# Altium schematic sheet Power and MCU.SchDoc
size A4
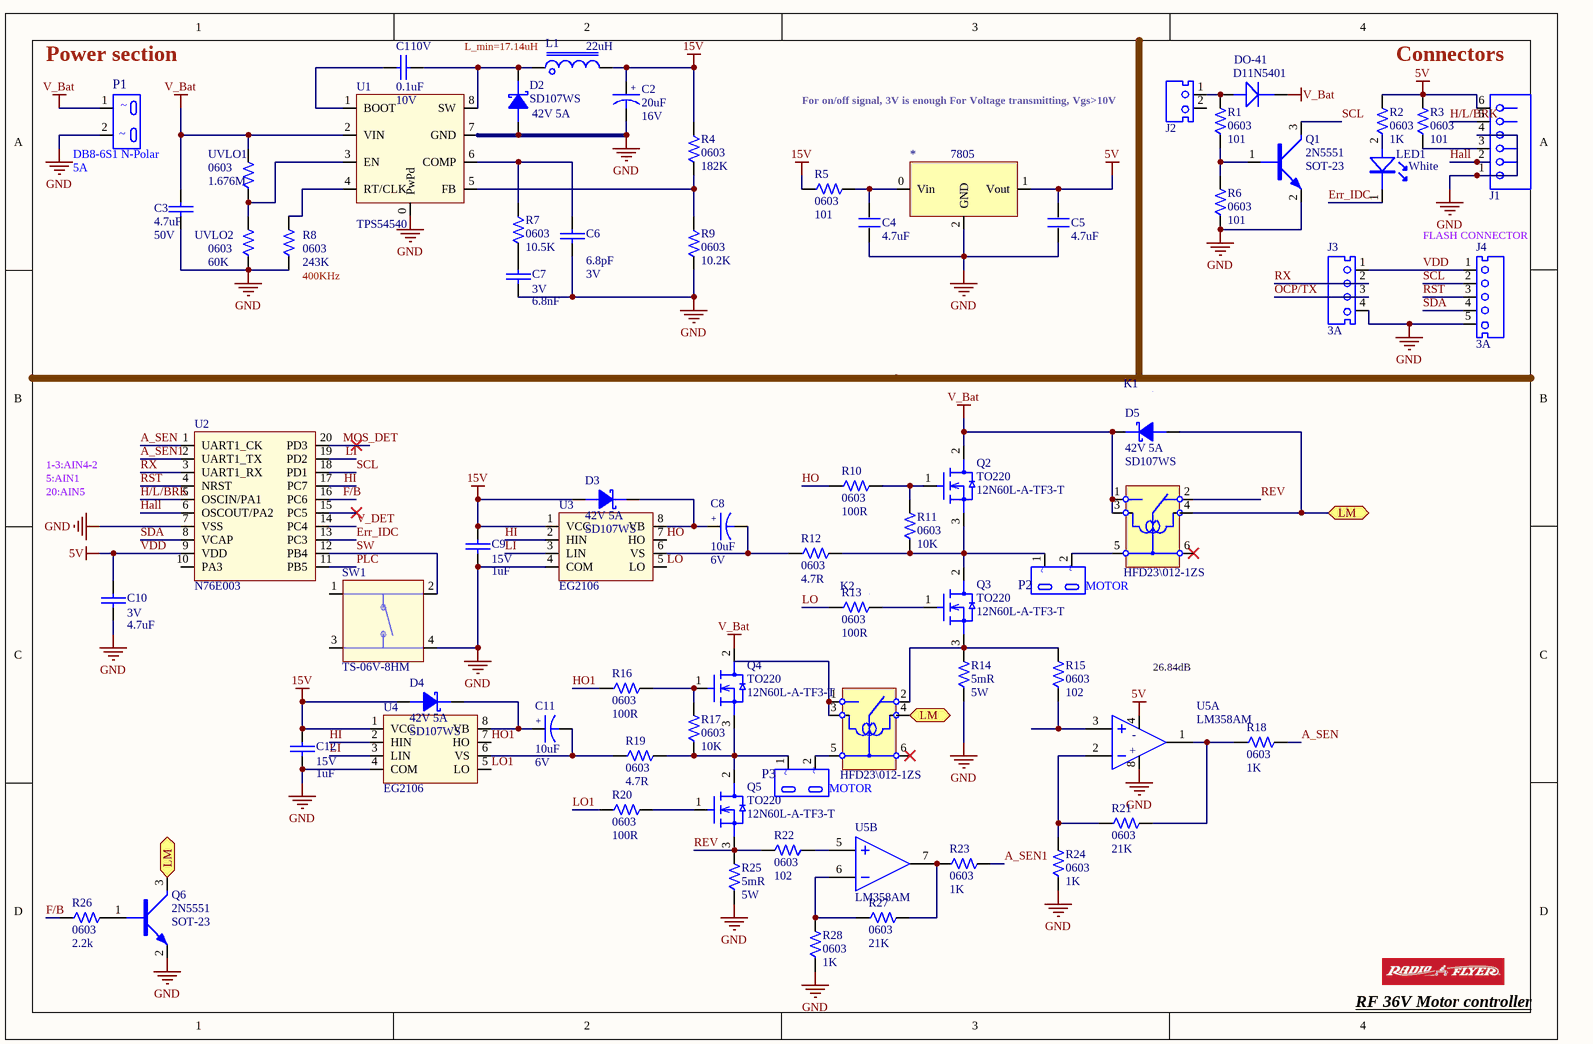
[diagram p0: Power and MCU.SchDoc]

## Parts
*  7805  [2SC2712GR]
C1  10V  value 0.1uF  [CAPC0201]
C2  value 20uF  Voltage: 16V  [CASE - D]  (hidden comment: PBE099540-1010)
C3  value 4.7uF  Voltage: 50V  [CAPC0201]  (hidden comment: 10V)
C4  4.7uF  [0603P]
C5  4.7uF  [0603P]
C6  value 6.8pF  Voltage: 3V  [CAPC0201]  (hidden comment: 10V)
C7  value 6.8nF  [CAPC0201]  (hidden comment: 3V)
C8  value 10uF  Voltage: 6V  [CASE - D]  (hidden comment: PBE099540-1010)
C9  value 1uF  Voltage: 15V  [CAPC0201]  (hidden comment: 3V)
C10  value 4.7uF  [CAPC0201]  (hidden comment: 3V)
C11  value 10uF  Voltage: 6V  [CASE - D]  (hidden comment: PBE099540-1010)
C12  value 1uF  Voltage: 15V  [CAPC0201]  (hidden comment: 3V)
D1  MFG Part: 1N5401  Package: DO-41  [DO-41-V-P5.08]  (hidden comment: RAD114004-0010)
D2  42V 5A  [SOD-323]
D3  42V 5A  [SOD-323]
D4  42V 5A  [SOD-323]
D5  42V 5A  [SOD-323]
J1  T690300121600  [CONN 6P PH=2.5mm RA XHB-6AW-KL]  (value not drawn)
J2  T690300125300  [CONN 2P PH=2.5mm HAA250A-2 WHITE]  (value not drawn)
J3  Current: 3A  [CONN 4P PH=2.5mm B4B-XH-A]  (hidden comment: CCN250000-0104)
J4  Current: 3A  [CONN 5P PH=2.5mm B5B-XH-A]  (hidden comment: CCN250000-0105)
K1  MFG Part: HFD23\012-1ZS  [RELAY HFD23/012-1ZS]  (hidden comment: RELAY HFD23/012-1ZS)
K2  MFG Part: HFD23\012-1ZS  [RELAY HFD23/012-1ZS]  (hidden comment: RELAY HFD23/012-1ZS)
L1  value 22uH  [IND CSAB0740]  (hidden comment: T621000090500)
LED1  Color: White  [LED 0603 JH-CW52E12SMP001]  (hidden comment: T575013160258)
P1  MFG Part: DB8-6S1 N-Polar  Current: 5A  [AC INLET 2P DB8-6S1]  (hidden comment: CJP012009-0050)
P2  MFG Part: MOTOR  [AC INLET 2P ST-A03-002MS]  (hidden comment: CJPA12002-0010)
P3  MFG Part: MOTOR  [AC INLET 2P ST-A03-002MS]  (hidden comment: CJPA12002-0010)
Q1  MFG Part: 2N5551  Package: SOT-23  [SOT23-132-RW]  (hidden comment: RCN000846-0001)
Q2  Package: TO220  [TO220-F]  (hidden comment: RHM120060-1001)
Q3  Package: TO220  [TO220-F]  (hidden comment: RHM120060-1001)
Q4  Package: TO220  [TO220-F]  (hidden comment: RHM120060-1001)
Q5  Package: TO220  [TO220-F]  (hidden comment: RHM120060-1001)
Q6  MFG Part: 2N5551  Package: SOT-23  [SOT23-132-RW]  (hidden comment: RCN000846-0001)
R1  value 101  Package: 0603  [0603-RW]  (hidden comment: T501348102129)
R2  value 1K  Package: 0603  [0603-RW]  (hidden comment: T501348102129)
R3  value 101  Package: 0603  [0603-RW]  (hidden comment: T501348102129)
R4  value 182K  Package: 0603  [0603-RW]  (hidden comment: T501348102129)
R5  value 101  Package: 0603  [0603-RW]  (hidden comment: T501348102129)
R6  value 101  Package: 0603  [0603-RW]  (hidden comment: T501348102129)
R7  value 10.5K  Package: 0603  [0603-RW]  (hidden comment: T501348102129)
R8  value 243K  Package: 0603  [0603-RW]  (hidden comment: T501348102129)
R9  value 10.2K  Package: 0603  [0603-RW]  (hidden comment: T501348102129)
R10  value 100R  Package: 0603  [0603-RW]  (hidden comment: T501348102129)
R11  value 10K  Package: 0603  [0603-RW]  (hidden comment: T501348102129)
R12  value 4.7R  Package: 0603  [0603-RW]  (hidden comment: T501348102129)
R13  value 100R  Package: 0603  [0603-RW]  (hidden comment: T501348102129)
R14  value 5mR  Power: 5W  [5W-22X10-H]  (hidden comment: QHE505000-5190)
R15  value 102  Package: 0603  [0603-RW]  (hidden comment: T501348102129)
R16  value 100R  Package: 0603  [0603-RW]  (hidden comment: T501348102129)
R17  value 10K  Package: 0603  [0603-RW]  (hidden comment: T501348102129)
R18  value 1K  Package: 0603  [0603-RW]  (hidden comment: T501348102129)
R19  value 4.7R  Package: 0603  [0603-RW]  (hidden comment: T501348102129)
R20  value 100R  Package: 0603  [0603-RW]  (hidden comment: T501348102129)
R21  value 21K  Package: 0603  [0603-RW]  (hidden comment: T501348102129)
R22  value 102  Package: 0603  [0603-RW]  (hidden comment: T501348102129)
R23  value 1K  Package: 0603  [0603-RW]  (hidden comment: T501348102129)
R24  value 1K  Package: 0603  [0603-RW]  (hidden comment: T501348102129)
R25  value 5mR  Power: 5W  [5W-22X10-H]  (hidden comment: QHE505000-5190)
R26  value 2.2k  Package: 0603  [0603-RW]  (hidden comment: T501348102129)
R27  value 21K  Package: 0603  [0603-RW]  (hidden comment: T501348102129)
R28  value 1K  Package: 0603  [0603-RW]  (hidden comment: T501348102129)
SW1  MFG Part: TS-06V-8HM  [TS_6X6X8_DIP]  (hidden comment: MSWA06012-0010)
U1  TPS54540  [SO8-EP]
U2  RCI800336-0001  [N76E003]  (value not drawn)
U3  MFG Part: EG2106  [SO8]  (hidden comment: T610900027257)
U4  MFG Part: EG2106  [SO8]  (hidden comment: T610900027257)
U5  RCI000358-0001  [SO8]  (value not drawn)  (parts A,B of 2)
UVLO1  value 1.676M  Package: 0603  [0603-RW]  (hidden comment: T501348102129)
UVLO2  value 60K  Package: 0603  [0603-RW]  (hidden comment: T501348102129)

## Ports
LM (bidir)

## Nets
15V: C2.1 C9.2 C12.2 D3.1(A) D4.1(A) L1.2 R4.1 R5.1 U3.1(VCC) U4.1(VCC)
GND: *.2(GND) C2.2 C3.1 C4.1 C5.1 C6.1 C7.1 C9.1 C10.1 C12.1 D2.1(A) J1.1 J1.4 J3.4 J4.5 P1.2 Q1.2(E) Q6.2(E) R6.1 R8.1 R9.2 R14.1 R24.1 R25.1 R28.1 SW1.4 U1.0(PwPd) U1.7(GND) U2.7(VSS) U3.4(COM) U4.4(COM) U5.8 UVLO2.1
V_Bat: C3.2 D1.2(K) D5.2(K) K1.1 K1.3 P1.1 Q2.2(D) Q4.2(D) U1.2(VIN) UVLO1.2
VDD: *.1(Vout) C5.2 C10.2 J1.6 J3.1 J4.1 R2.2 R3.2 U2.9(VDD) U5.4  [also labelled 5V]
A_SEN: R18.2 U2.1(UART1_CK)
A_SEN1: R23.2 U2.2(UART1_TX)
Err_IDC: LED1.1(K) U2.13(PC3)
F/B: R26.1 U2.16(PC6)
H/L/BRK: J1.5 U2.5(OSCIN/PA1)
Hall: J1.2 U2.6(OSCOUT/PA2)
HI: U2.17(PC7) U3.2(HIN) U4.2(HIN)
HO: R10.1 U3.7(HO)
HO1: R16.1 U4.7(HO)
LI: U2.19(PD2) U3.3(LIN) U4.3(LIN)
LM: D5.1(A) K1.4 K2.4 Q6.3(C) ; port LM
LO: R13.1 U3.5(LO)
LO1: R20.1 U4.5(LO)
MOS_DET: U2.20(PD3)
OCP/TX: J3.3
PLC: U2.11(PB5)
REV: K1.2 Q5.3(S) R22.2 R25.2
RST: J4.3 U2.4(NRST)
RX: J3.2 U2.3(UART1_RX)
SCL: J4.2 Q1.3(C) U2.18(PD1)
SDA: J4.4 U2.8(VCAP)
SW: SW1.2 U2.12(PB4)
V_DET: U2.14(PC4)
Net*_0: *.0(Vin) C4.2 R5.2
NetC1_1: C1.1 U1.1(BOOT)
NetC1_2: C1.2 D2.2(K) L1.1 U1.8(SW)
NetC6_2: C6.2 R7.1 U1.6(COMP)
NetC7_2: C7.2 R7.2
NetC8_1: C8.1 D3.2(K) U3.8(VB)
NetC8_2: C8.2 R12.1 U3.6(VS)
NetC11_1: C11.1 D4.2(K) U4.8(VB)
NetC11_2: C11.2 R19.1 U4.6(VS)
NetD1_1: D1.1(A) J2.1 R1.2
NetJ1_3: J1.3 R3.1
NetK1_5: K1.5 P2.2
NetK2_1: K2.1 K2.3
NetK2_2: K2.2 Q3.3(S) R14.2 R15.2
NetK2_5: K2.5 P3.2
NetLED1_2: LED1.2(A) R2.1
NetP2_1: P2.1 Q2.3(S) Q3.2(D) R11.1 R12.2
NetP3_1: P3.1 Q4.3(S) Q5.2(D) R17.1 R19.2
NetQ1_1: Q1.1(B) R1.1 R6.2
NetQ2_1: Q2.1(G) R10.2 R11.2
NetQ3_1: Q3.1(G) R13.2
NetQ4_1: Q4.1(G) R16.2 R17.2
NetQ5_1: Q5.1(G) R20.2
NetQ6_1: Q6.1(B) R26.2
NetR4_2: R4.2 R9.1 U1.5(FB)
NetR8_2: R8.2 U1.4(RT/CLK)
NetR15_1: R15.1 U5.3(IN+)
NetR18_1: R18.1 R21.2 U5.1(OUT)
NetR21_1: R21.1 R24.2 U5.2(IN-)
NetR22_1: R22.1 U5.5(IN+)
NetR23_1: R23.1 R27.2 U5.7(OUT)
NetR27_1: R27.1 R28.2 U5.6(IN-)
NetU1_3: U1.3(EN) UVLO1.1 UVLO2.2

Not connected (* = marked no-connect by the designer): J2 2; K1 6*; K2 6*; SW1 1 3; U2 10(PA3) 15(PC5)*

## Notes on the sheet
- L_min=17.14uH
- (near P1) Power section
- (near J2) For on/off signal, 3V is enough For Voltage transmitting, Vgs>10V
- Connectors
- (near J4) FLASH CONNECTOR
- (near R8) 400KHz
- 1-3:AIN4-2
- 5:AIN1
- 20:AIN5
- 26.84dB
- RF 36V Motor controller
- (in symbol AC INLET 2P DB8-6S1 N-Polar) ~
- (in symbol AC INLET 2P ST-A03-002MS) ~
- (in symbol CAP E 100uF 16V 20% SMD) +
- (in symbol LM358AM, part A) -; +

## Library data of the parts
C1 C3 C6 C7 C9 C10 C12 = CAP0201 0.1uF 10V 10%_X5R_MURATA: CAP X5R .10UF 10V +-10% 0201 MURATA L; MFG Part: GRM033R61A104KE15D; SAP: T545091047205; Tolerance: 10%; Type: Capacitor; CREATE_NAME: Nathan; DIP&SMD: SMD; PACKAGE: CAPC0201; Vendor Code: *; Vendor Name: *; MFG: MURATA; Other: X5R; CREATE_TIME: 01-Nov-2018; Customer Specific: N/A
  C1: Voltage: 10V
  C7 C10: Voltage: 3V
C2 C8 C11 = CAP E 100uF 16V 20% SMD: CHIP ELECT 100uF 16V 20% SMD 6.3x5.4mm; SAP: T551101434030; Vendor Name: 深圳市春明电子有限公司; Vendor Code: 10020343; Type: Capacitor; PACKAGE: CASE - D; MFG: *; MFG Part: *; Other: *; Tolerance: 20%; DIP&SMD: SMD; Customer Specific: N/A
C4 C5 = C
D1 = 1N4004S: GP DIODE  1N4004 1A 280VRMS DO-41; MFG: PANJIT; SAP: T571002250423; Vendor Name: 深圳市春明电子有限公司; Vendor Code: 10020343; Voltage: 400V; DIP&SMD: DIP; Current: 1A; Type: DIODE; Customer Specific: N/A
D2-D5 = SD107WS: Schottky Diodes , SOD-323; MFG: Micro Commercial Components; Type: DIODE; DIP&SMD: SMD; CREATE_NAME: Nathan; SAP: *; Vendor Name: *; Vendor Code: *; Voltage: *; Current: *; Customer Specific: N/A; CREATE_TIME: 17-Nov-2020; Package: SOD-323; MFG Part: SD107WS
J1 = CONN PH 6P PH=2.5mm RA XHB-6AW-KL: CONNECTOR 6PIN P=2.5 WHITE 90 K; Value: 2.5mm; MFG: 金佳电子; CREATE_NAME: Nathan; DIP&SMD: DIP; SAP: T690300121600; MFG Part: XHB-6AW-KL; Vendor Name: *; Vendor Code: *; Type: Connector; Current: *; CREATE_TIME: 27-Sep-2017
J2 = CONN 2P PH=2.5mm HAA250A-2 BLACK: CONNECTOR HA2.5 2PIN BLACK K; Value: 2.5mm; MFG: 金瑞康; CREATE_NAME: Nathan; Current: 3A; DIP&SMD: DIP; SAP: T690300125300; MFG Part: HAA250A-2 BLACK; Vendor Name: *; Vendor Code: *; Type: Connector; CREATE_TIME: 24-Nov-2017
J3 = CONN 4P PH=2.5mm B4B-XH-A: GP CONNECTOR B4B-XH-A 4 PIN; Value: 2.5mm; SAP: T690300029000; Vendor Name: 亿源电子有限公司; Vendor Code: 10009989; DIP&SMD: DIP; MFG: *; MFG Part: *; Type: Connector
J4 = CONN 5P PH=2.5mm B5B-XH-A: CONNECTOR B5B-XH-A 5 PIN; Value: 2.5mm; SAP: T690300029100; Vendor Name: 深圳市利民丰电子有限公司; Vendor Code: 10020373; DIP&SMD: DIP; MFG: *; MFG Part: *; Type: Connector
K1 K2 = RELAY HFD23/012-1ZS: MFG: HF; Voltage: 12V; CREATE_NAME: Nathan; DIP&SMD: DIP; SAP: *; Vendor Code: *; Vendor Name: *; Type: RELAY; Current: *; CREATE_TIME: 22-Mar-2021
L1 = IND 22uH CSAB0740-220M: 22UH 4A 100K SMD CODACA CSAB074 K; Type: INDUCTOR; CREATE_NAME: Nathan; DCR: 125 mohm (max.); Tolerance: 20%; SAP: T621000090500; MFG: CODACA; Vendor Code: *; Vendor Name: *; CREATE_TIME: 30-Aug-2019; Current: 4A; MFG Part: CSAB0740-220M; DIP&SMD: SMD; Customer Specific: N/A
LED1 = LED 0603 JH-CW52E12SMP001: LED W WHI 0602 JH-CW52E12SM MINGSHOU L; CREATE_NAME: Tom; DIP&SMD: SMD; MFG Part: JH-CW52E12SMP001; SAP: T575013160258; Package: 0603; MFG: MINGSHOU; Type: LED
P1 = AC INLET 2P DB8-6S1 N-Polar: AC SOCKET 2P D2.36 2.5A 250V VDE BLACK; SAP: T690300011500; MFG: 金明浩; Vendor Name: 深圳市金明浩电子科技有限公司; Vendor Code: 10010007; DIP&SMD: DIP; Value: *; Type: Connector
P2 P3 = AC INLET 2P ST-A03-002MS: AC IN SOCKET ST-A03-002MS; SAP: T690300012000; MFG: 金明浩; Vendor Name: 深圳市金明浩电子科技有限公司; Vendor Code: 10010007; DIP&SMD: DIP; Value: *; Type: Connector
Q1 Q6 = LBC846BLT1G: NPN LRC BC846BLT1G SOT23; SAP: T581003640437; Vendor Code: 10009129; Vendor Name: WING HING ENTERPRISE CO; DIP&SMD: SMD; MFG: LRC; Power: *; Voltage: *; Type: NPN; Customer Specific: N/A
Q2-Q5 = 12N60L-A-TF3-T: MOSFET 3PIN 12N60L-A -TF3-T TO-220F; SAP: T586002570924; Vendor Code: 10020223; Vendor Name: 丰富利科技（深圳）有限公司; Voltage: 600V; MFG: UTC; Current: 12A; DIP&SMD: DIP; Power: *; Type: MOSFET; Customer Specific: N/A; MFG Part: 12N60L-A-TF3-T
R1-R13 R15-R24 R26-R28 UVLO1 UVLO2 = RES0603 1/16W 0.1% 3.48K OHM: CHIP 3.48K OHM 50PPM +-0.1% 0603 WALS L; MFG Part: WF06T3481BTL; TOL: 0.1%; MFG: WALSIN; Power: 1/16 W; CREATE_NAME: Tom; DIP&SMD: SMD; SAP: T501348102129; Vendor Code: *; Vendor Name: *; Type: Resistor; CREATE_TIME: 12-Apr-2016; Customer Specific: N/A
R14 R25 = RES 5W 5% 5.1 OHM W10D9.5L22H22 QHE-5190: CEMENT RESISTOR 5.1OHM 5W 5% AXIAL; SAP: T710600010200; MFG: Xingdacheng; Vendor Code: 10008495; Vendor Name: 深圳市兴达诚电子有限公司; DIP&SMD: DIP; Package: 5W; TOL: 5%; MFG Part: RES 5W 5% 5.1 OHM W10D9.5L22H22 QHE; Type: Resistor; Customer Specific: N/A
SW1 = TACT SW H8.0 DIP: TACT SWITC 4P L6*W6*H8mm; SAP: T670200001500; MFG: ShenZhen GanHad; Force: 250gf; DIP&SMD: DIP; Vendor Code: *; Vendor Name: *; Value: TACT; Voltage: *; Current: *; Type: Switch
U1 = TPS54540: 4.5-42V input 5A output
U2 = N76E003: IC MCU 20P TSSOP20; MFG: ST; SAP: T610300083725; CREATE_NAME: GordonL@Deftronics; DIP&SMD: SMD; Vendor Code: *; Vendor Name: *; Type: IC; CREATE_TIME: 23-Mar-2014; Customer Specific: N/A; MFG Part: N76E003
U3 U4 = 2ED2106S06F: DRIVER 2ED2106S06F DSO-8 INFINEO K; MFG: Infineon; CREATE_NAME: Nathan; DIP&SMD: SMD; Vendor Code: *; Vendor Name: *; SAP: T610900027257; Type: IC; CREATE_TIME: 14-Apr-2020; Customer Specific: N/A
U5 = LM358AM: IC OP-AMP Dual LM358 DUAL OP-AMP SOIC8; SAP: T610500008001; Vendor Code: 10020355; Vendor Name: SERIAL MICROELECTRONICS (HK) LIMITE; MFG: National SEMI; DIP&SMD: SMD; Type: IC AMP; Customer Specific: N/A; MFG Part: LM358AM